# Altium project nufsr-p00.PrjPcb
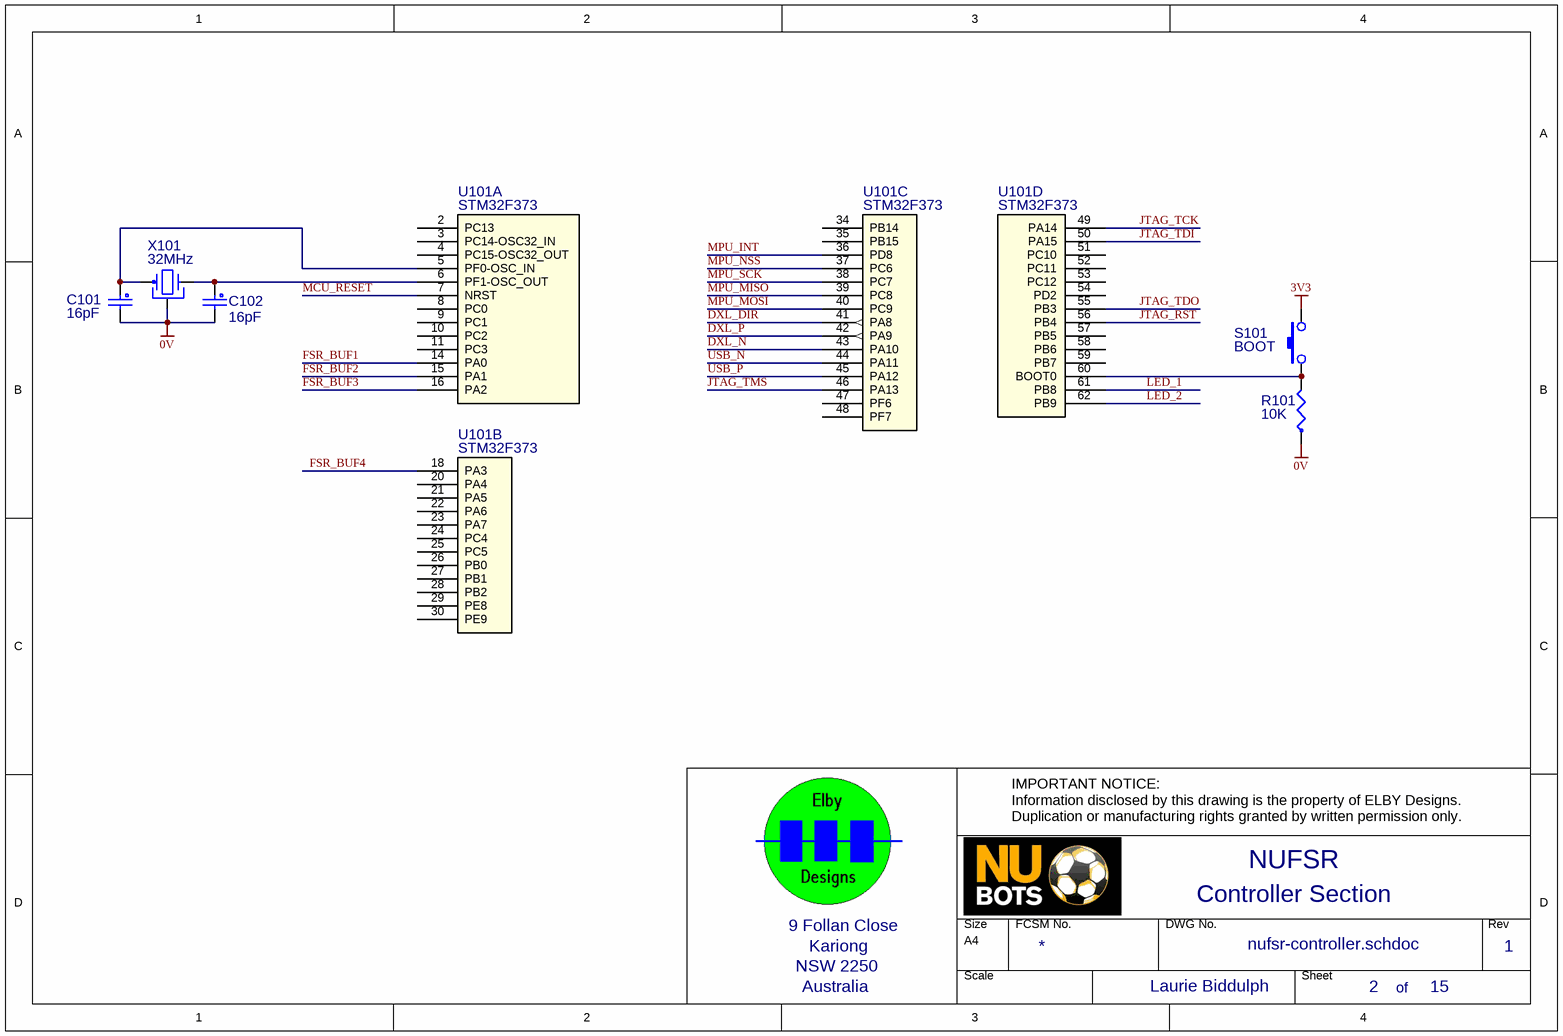
[diagram p0: nufsr-controller.schdoc]
PrjTitle: NUFSR
7 sheets, 76 parts. Net scope: global (net labels, ports and power ports of the same name join across sheets).
Board file: nufsr-p00.PcbDoc
Sheets:
  nufsr-controller.schdoc
  nufsr-fsr.schdoc
  nufsr-motion-sensor.schdoc
  nufsr-power.schdoc
    DECOUPLING = nufsr-power-decoupling.schdoc
  nufsr-rs485.schdoc
  nufsr-user-io.schdoc

## Sheet nufsr-controller.schdoc: NUSense
size A4; Organization: Elby Designs; Address1: 9 Follan Close; Address2: Kariong; Address3: NSW 2250; Address4: Australia; Revision: 1; SheetNumber: 2; SheetTotal: 15; DrawnBy: Controller Section; Engineer: Laurie Biddulph; PageSetup: Record=PageOptions|CenterHorizontal=True|CenterVertical=True|PrintScale=1.38|XCorrection=1.00|YCorrection=1.00|PrintKind=1|BorderSize=5000000|LeftOffset=0|BottomOffset=0|Orientation=2|PaperLength=1000|PaperWidth=1000|Scale=100|PaperSource=7|PrintQuality=-4|MediaType=1|DitherType=10|PaperKind=A3|PrintScaleMode=1

### Parts
C101  16pF  [0805(LB)]
C102  16pF  [0805(LB)]
R101  10K  [0603(LB)]
S101  BOOT  [HDR1X2(LB)]
U101  STM32F373  [LQFP-64_10x10(LB)]  (parts A,B,C,D of 5)
X101  32MHz  [CRYSTAL-3(LB)]

### Nets
0V: C101.2 C102.2 R101.1 X101.3
3V3: S101.1(COM)
DXL_DIR: U101.41(PA8)
DXL_N: U101.43(PA10)
DXL_P: U101.42(PA9)
FSR_BUF1: U101.14(PA0)
FSR_BUF2: U101.15(PA1)
FSR_BUF3: U101.16(PA2)
FSR_BUF4: U101.18(PA3)
JTAG_RST: U101.56(PB4)
JTAG_TCK: U101.49(PA14)
JTAG_TDI: U101.50(PA15)
JTAG_TDO: U101.55(PB3)
JTAG_TMS: U101.46(PA13)
LED_1: U101.61(PB8)
LED_2: U101.62(PB9)
MCU_~{RESET}: U101.7(NRST)
MPU_INT: U101.36(PD8)
MPU_MISO: U101.39(PC8)
MPU_MOSI: U101.40(PC9)
MPU_NSS: U101.37(PC6)
MPU_SCK: U101.38(PC7)
USB_N: U101.44(PA11)
USB_P: U101.45(PA12)
NetC101_1: C101.1 U101.5(PF0-OSC_IN) X101.1
NetC102_1: C102.1 U101.6(PF1-OSC_OUT) X101.2
NetR101_2: R101.2 S101.2(NO) U101.60(BOOT0)

Not connected (* = marked no-connect by the designer): U101 2(PC13) 3(PC14-OSC32_IN) 4(PC15-OSC32_OUT) 8(PC0) 9(PC1) 10(PC2) 11(PC3) 20(PA4) 21(PA5) 22(PA6) 23(PA7) 24(PC4) 25(PC5) 26(PB0) 27(PB1) 28(PB2) 29(PE8) 30(PE9) 34(PB14) 35(PB15) 47(PF6) 48(PF7) 51(PC10) 52(PC11) 53(PC12) 54(PD2) 57(PB5) 58(PB6) 59(PB7)

### Notes on the sheet
- IMPORTANT NOTICE:
  Information disclosed by this drawing is the property of ELBY Designs.
  Duplication or manufacturing rights granted by written permission only.
- of

### Library data of the parts
C101 C102 = CC-10PF(LB): NPO Low K, 50VDC Ceramic Disc; EMRP: CC-10PF
R101 = RM-10K(LB): 0.5W 1% Metal Film Resistor; EMRP: RM-10K
S101 = SW-PB-SPST(LB): PCB Push-button Switch; Text Field2: SP-0600
U101 = STM32F373: 32-bit Microcontroller; Manufacturer_Part_Number: stm32f74xzxt; Vendor: STMicroelectronics; C: Copyright (C) 2016 Accelerated Designs. All rights reserved; Copyright: Copyright (C) 2016 Accelerated Designs. All rights reserved; Value: Value; Type: Type; RefDes: RefDes
X101 = XTAL-24MHZ(LB): 24MHz Parallel-cut Crystal - HC49; EMRP: ZT-20MHZ

## Sheet nufsr-fsr.schdoc: NUSense
size A4; Organization: Elby Designs; Address1: 9 Follan Close; Address2: Kariong; Address3: NSW 2250; Address4: Australia; Revision: 1; SheetNumber: 12; SheetTotal: 15; DrawnBy: Force-Sense Resistors (FSR); Engineer: Laurie Biddulph; PageSetup: Record=PageOptions|CenterHorizontal=True|CenterVertical=True|PrintScale=1.38|XCorrection=1.00|YCorrection=1.00|PrintKind=1|BorderSize=5000000|LeftOffset=0|BottomOffset=0|Orientation=2|PaperLength=1000|PaperWidth=1000|Scale=100|PaperSource=7|PrintQuality=-4|MediaType=1|DitherType=10|PaperKind=A3|PrintScaleMode=1
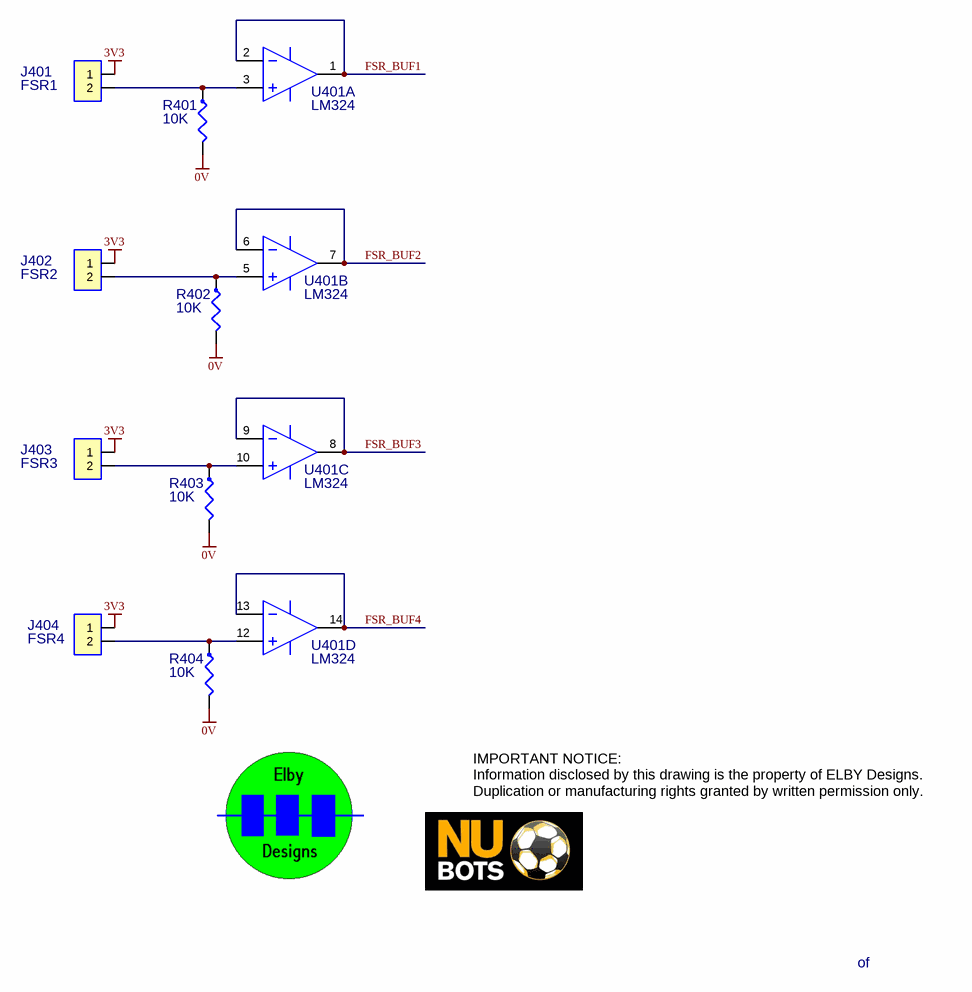
[diagram p1: nufsr-fsr.schdoc]

### Parts
J401  FSR1  [JST-B2B-PH]
J402  FSR2  [JST-B2B-PH]
J403  FSR3  [JST-B2B-PH]
J404  FSR4  [JST-B2B-PH]
R401  10K  [0603(LB)]
R402  10K  [0603(LB)]
R403  10K  [0603(LB)]
R404  10K  [0603(LB)]
U401  LM324  [SO-14(LB)]  (parts A,B,C,D of 5)

### Nets
0V: R401.2 R402.2 R403.2 R404.2
3V3: J401.1 J402.1 J403.1 J404.1
FSR_BUF1: U401.1(OUT) U401.2(IN1-)
FSR_BUF2: U401.6(IN2-) U401.7(OUT)
FSR_BUF3: U401.8(OUT) U401.9(IN3-)
FSR_BUF4: U401.13(IN4-) U401.14(OUT)
NetJ401_2: J401.2 R401.1 U401.3(IN1+)
NetJ402_2: J402.2 R402.1 U401.5(IN2+)
NetJ403_2: J403.2 R403.1 U401.10(IN3+)
NetJ404_2: J404.2 R404.1 U401.12(IN4+)

### Notes on the sheet
- IMPORTANT NOTICE:
  Information disclosed by this drawing is the property of ELBY Designs.
  Duplication or manufacturing rights granted by written permission only.
- of

### Library data of the parts
J401-J404 = CON2(LB): EMRP: HM-3412 + HM-3402
R401-R404 = RM-10K(LB): as R101 on sheet nufsr-controller
U401 = LM324(LB): Quad Low-noise JFET Op-amp; EMRP: SI-3-LM324

## Sheet nufsr-motion-sensor.schdoc: NUSense
size A4; Organization: Elby Designs; Address1: 9 Follan Close; Address2: Kariong; Address3: NSW 2250; Address4: Australia; Revision: 1; SheetNumber: 3; SheetTotal: 15; DrawnBy: Motion Tracking Sensor; Engineer: Laurie Biddulph; PageSetup: Record=PageOptions|CenterHorizontal=True|CenterVertical=True|PrintScale=1.38|XCorrection=1.00|YCorrection=1.00|PrintKind=1|BorderSize=5000000|LeftOffset=0|BottomOffset=0|Orientation=2|PaperLength=1000|PaperWidth=1000|Scale=100|PaperSource=7|PrintQuality=-4|MediaType=1|DitherType=10|PaperKind=A3|PrintScaleMode=1
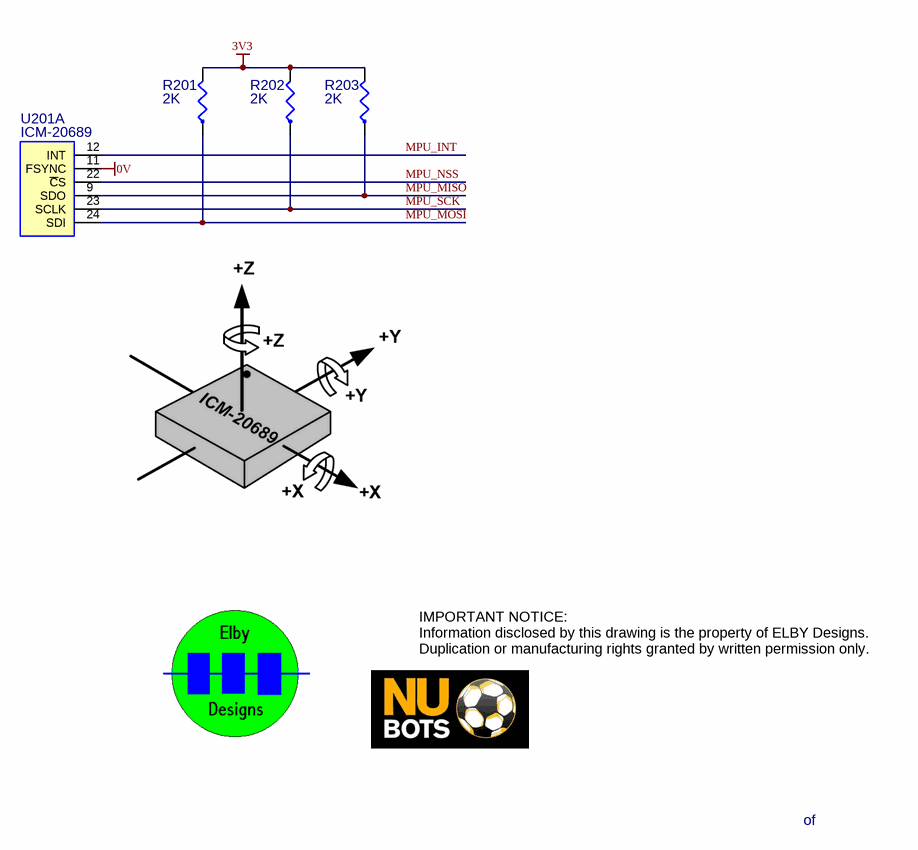
[diagram p2: nufsr-motion-sensor.schdoc]

### Parts
R201  2K  [0603(LB)]
R202  2K  [0603(LB)]
R203  2K  [0603(LB)]
U201  ICM-20689  [QFN-24]  (part A of 3)

### Nets
0V: U201.11(FSYNC)
3V3: R201.2 R202.2 R203.2
MPU_INT: U201.12(INT)
MPU_MISO: R203.1 U201.9(SDO)
MPU_MOSI: R201.1 U201.24(SDI)
MPU_NSS: U201.22(~{C}S)
MPU_SCK: R202.1 U201.23(SCLK)

### Notes on the sheet
- IMPORTANT NOTICE:
  Information disclosed by this drawing is the property of ELBY Designs.
  Duplication or manufacturing rights granted by written permission only.
- of

### Library data of the parts
R201-R203 = RM-2K(LB): 0.5W 1% Metal Film Resistor; EMRP: RM-2K
U201 = ICM-20869: Motion Tracking

## Sheet nufsr-power.schdoc: NUSense
size A4; Organization: Elby Designs; Address1: 9 Follan Close; Address2: Kariong; Address3: NSW 2250; Address4: Australia; Revision: 1; SheetNumber: 14; SheetTotal: 15; DrawnBy: Power Supply; Engineer: Laurie Biddulph; PageSetup: Record=PageOptions|CenterHorizontal=True|CenterVertical=True|PrintScale=1.38|XCorrection=1.00|YCorrection=1.00|PrintKind=1|BorderSize=5000000|LeftOffset=0|BottomOffset=0|Orientation=2|PaperLength=1000|PaperWidth=1000|Scale=100|PaperSource=7|PrintQuality=-4|MediaType=1|DitherType=10|PaperKind=A3|PrintScaleMode=1
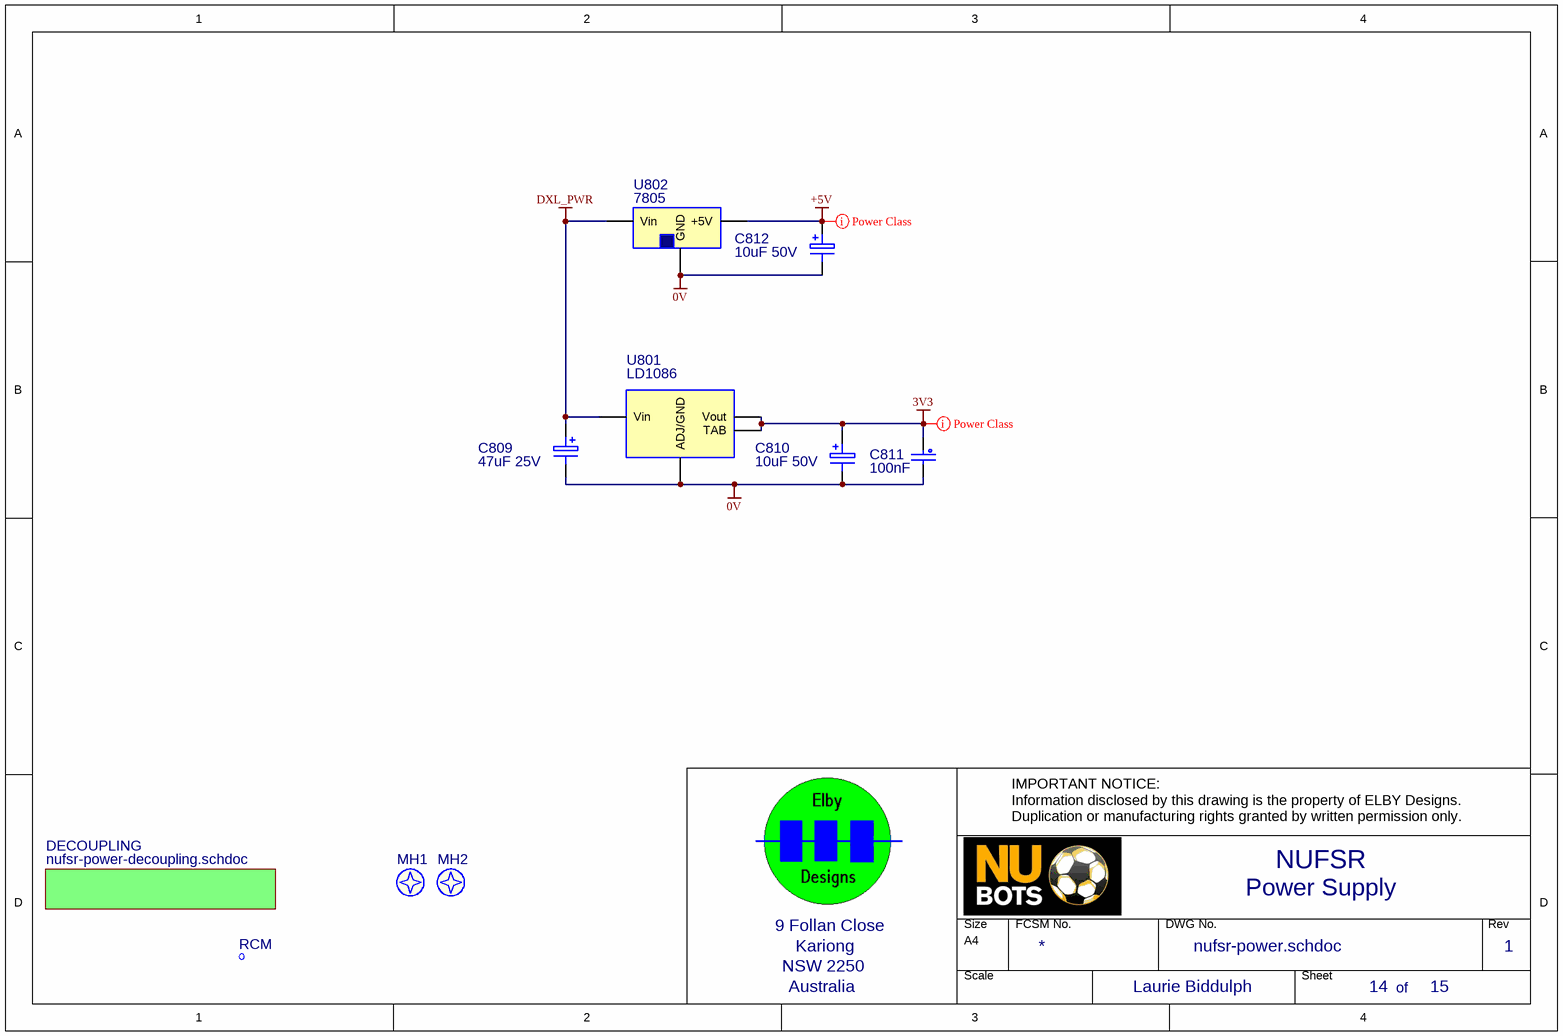
[diagram p3: nufsr-power.schdoc]

### Parts
C809  47uF 25V  [CASE-D(LB)]
C810  10uF 50V  [RB-D6.3-P2.5]
C811  100nF  [0603(LB)]
C812  10uF 50V  [RB-D6.3-P2.5]
MH1  Fixing  [HW-FIXING-3MM-PLASTIC]  (value not drawn)
MH2  Fixing  [HW-FIXING-3MM-PLASTIC]  (value not drawn)
RCM  HW-RCM(LB)  [HW-RCM]  (value not drawn)
U801  LD1086  [DPAK(LB)]
U802  7805  [DPAK(LB)]

### Sub-sheets
DECOUPLING = nufsr-power-decoupling.schdoc: no entries

### Nets
0V: C809.2 C810.2 C811.2 C812.2 U801.1(ADJ/GND) U802.2(GND)
3V3: C810.1 C811.1 U801.2(Vout) U801.TAB
+5V: C812.1 U802.3(+5V)
DXL_PWR: C809.1 U801.3(Vin) U802.1(Vin)

Not connected (* = marked no-connect by the designer): U802 TAB

### Layout directives
net class PowerClass: 3V3, +5V

### Notes on the sheet
- IMPORTANT NOTICE:
  Information disclosed by this drawing is the property of ELBY Designs.
  Duplication or manufacturing rights granted by written permission only.
- of

### Library data of the parts
C809 = CT-47UF35V(LB): 20% 35V Resin-dipped Tantalum; EMRP: CT-47UF
C810 C812 = CE-10UF50V(LB): 20% 50V Aluminium Electrolytic; EMRP: CE-10UF
C811 = CC-100NF(LB): Monolithic Ceramic; EMRP: CC-100NF
MH1 MH2 = HW-FIXING-ISOLATED(LB): M3/M4 Fixing Hole; EMRP: NA
RCM = HW-RCM(LB): N-Tick; EMRP: NA
U801 = LD1086(LB): 3-terminal Positive Voltage Regulator; Text Field1: 347-6870; Text Field2: ZV-1615; Text Field3: 512-KA317
U802 = 7805(LB): 3-terminal 1Amp Fixed Voltage Regulator; EMRP: SI-4-7805

## Sheet nufsr-power-decoupling.schdoc: NUSense
size A4; Organization: Elby Designs; Address1: 9 Follan Close; Address2: Kariong; Address3: NSW 2250; Address4: Australia; Revision: 1; SheetNumber: 15; SheetTotal: 15; DrawnBy: Power Supply Decoupling; Engineer: Laurie Biddulph; PageSetup: Record=PageOptions|CenterHorizontal=True|CenterVertical=True|PrintScale=1.38|XCorrection=1.00|YCorrection=1.00|PrintKind=1|BorderSize=5000000|LeftOffset=0|BottomOffset=0|Orientation=2|PaperLength=1000|PaperWidth=1000|Scale=100|PaperSource=7|PrintQuality=-4|MediaType=1|DitherType=10|PaperKind=A3|PrintScaleMode=1
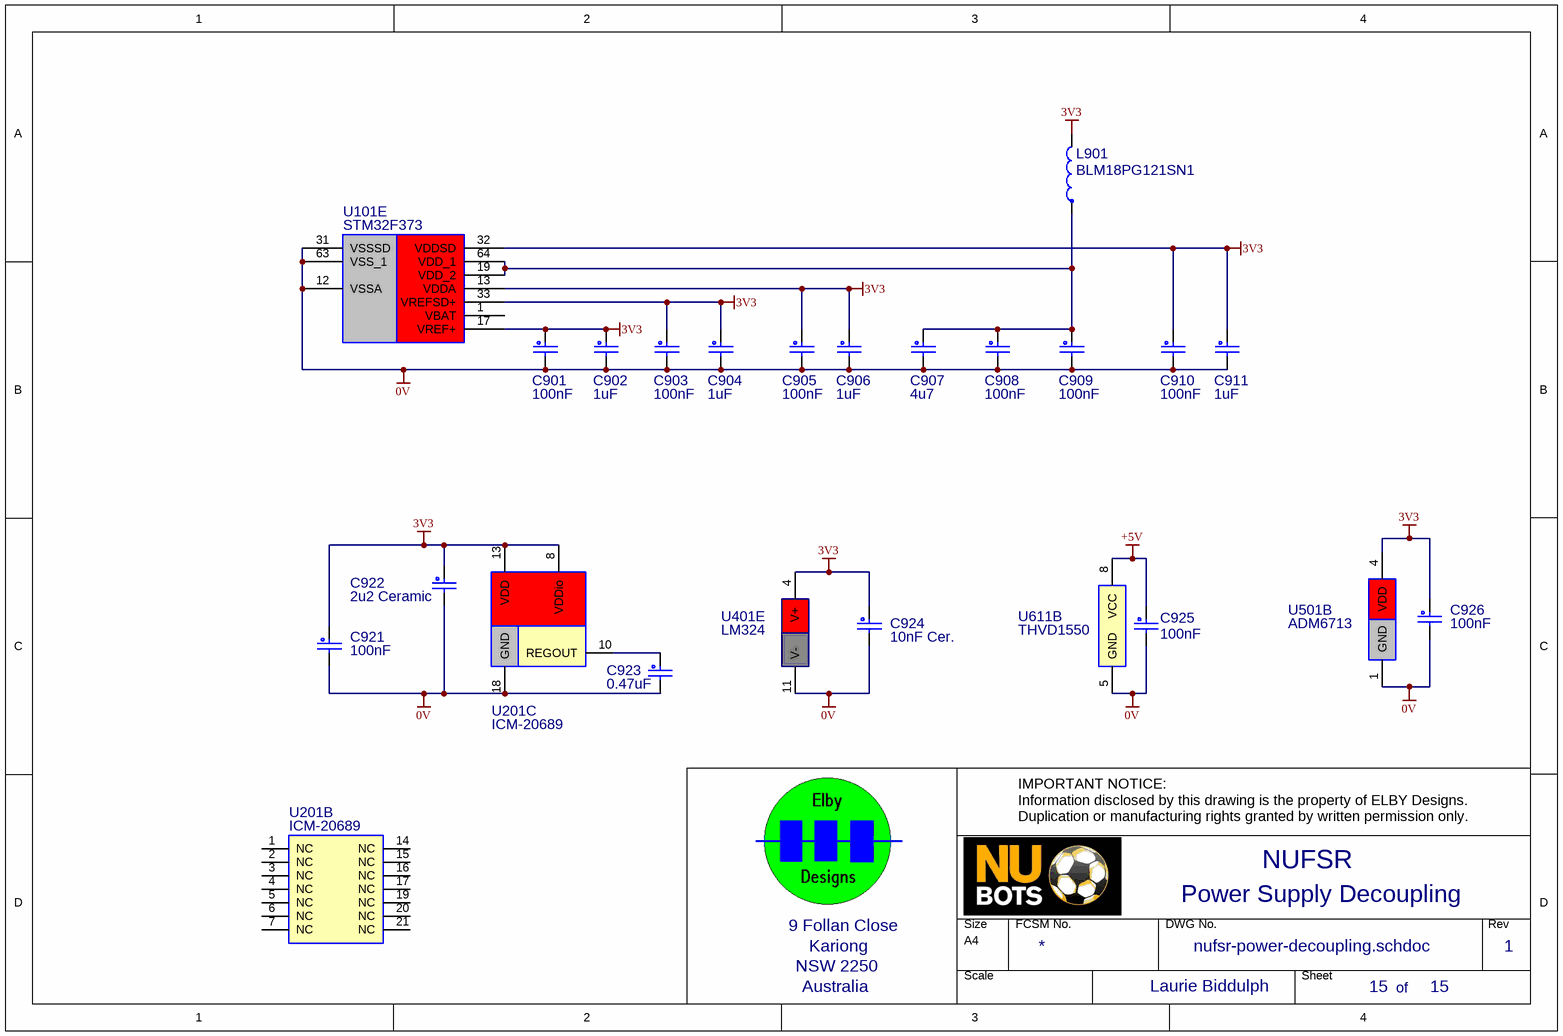
[diagram p4: nufsr-power-decoupling.schdoc]

### Parts
C901  100nF  [0603(LB)]
C902  1uF  [0805(LB)]
C903  100nF  [0603(LB)]
C904  1uF  [0805(LB)]
C905  100nF  [0603(LB)]
C906  1uF  [0805(LB)]
C907  4u7  [0805(LB)]
C908  100nF  [0603(LB)]
C909  100nF  [0603(LB)]
C910  100nF  [0603(LB)]
C911  1uF  [0805(LB)]
C921  100nF  [0603(LB)]
C922  2u2 Ceramic  [0805(LB)]
C923  0.47uF  [0805(LB)]
C924  10nF Cer.  [0603(LB)]
C925  100nF  [0603(LB)]
C926  100nF  [0603(LB)]
L901  value BLM18PG121SN1  [0603(LB)]  (hidden comment: Ferrite Bead)
U101  STM32F373  [LQFP-64_10x10(LB)]  (part E of 5)
U201  ICM-20689  [QFN-24]  (parts B,C of 3)
U401  LM324  [SO-14(LB)]  (part E of 5)
U501  ADM6713  [SC70-4]  (part B of 2)
U611  THVD1550  [SO-8(LB)]  (part B of 2)

### Nets
0V: C901.2 C902.2 C903.2 C904.2 C905.2 C906.2 C907.2 C908.2 C909.2 C910.2 C911.2 C921.2 C922.2 C923.2 C924.2 C925.2 C926.2 U101.12(VSSA) U101.31(VSSSD) U101.63(VSS_1) U201.18(GND) U401.11(V-) U501.1(GND) U611.5(GND)
3V3: C901.1 C902.1 C903.1 C904.1 C905.1 C906.1 C910.1 C911.1 C921.1 C922.1 C924.1 C926.1 L901.2 U101.13(VDDA) U101.17(VREF+) U101.32(VDDSD) U101.33(VREFSD+) U201.8(VDDio) U201.13(VDD) U401.4(V+) U501.4(VDD)
+5V: C925.1 U611.8(VCC)
NetC907_1: C907.1 C908.1 C909.1 L901.1 U101.19(VDD_2) U101.64(VDD_1)
NetC923_1: C923.1 U201.10(REGOUT)

Not connected (* = marked no-connect by the designer): U101 1(VBAT); U201 1(NC) 2(NC) 3(NC) 4(NC) 5(NC) 6(NC) 7(NC) 14(NC) 15(NC) 16(NC) 17(NC) 19(NC) 20(NC) 21(NC)

### Notes on the sheet
- IMPORTANT NOTICE:
  Information disclosed by this drawing is the property of ELBY Designs.
  Duplication or manufacturing rights granted by written permission only.
- of

### Library data of the parts
C901 C903 C905 C908-C910 C921 C925 C926 = CC-100NF(LB): Monolithic Ceramic; EMRP: CC-100NF
C902 C904 C906 C911 = CC-1000NF(LB): 1uF Ceramic; EMRP: CC-1000NF
C907 = CC-4700NF(LB): 4.7uF Ceramic; EMRP: CC-4700NF
C922 = CC-2200NF(LB): 2.2uF Ceramic; EMRP: CC-2200NF
C923 = CP-470NF(LB): 63V 10% Metallised Polyester; EMRP: CP-470NF
C924 = CC-10NF(LB): Monolithic Ceramic; EMRP: CC-10NF
L901 = FERRITE-BEAD(LB): EMRP: IN-BEAD
U101 = STM32F373: as U101 on sheet nufsr-controller; Copyright: Copyright (C) 2016 Accelerated Designs. All rights reserved; Value: Value; Type: Type; RefDes: RefDes
U201 = ICM-20869: Motion Tracking
U401 = LM324(LB): as U401 on sheet nufsr-fsr
U501 = ADM6713: Microprocessor Supervisory Circuit
U611 = THVD1550(LB): RS485 Transceiver 18kV 50mbps; EMRP: SI-1-MAX485

## Sheet nufsr-rs485.schdoc: NUSense
size A4; Organization: Elby Designs; Address1: 9 Follan Close; Address2: Kariong; Address3: NSW 2250; Address4: Australia; Revision: 1; SheetNumber: 7; SheetTotal: 15; DrawnBy: RS485; Engineer: Laurie Biddulph; PageSetup: Record=PageOptions|CenterHorizontal=True|CenterVertical=True|PrintScale=1.38|XCorrection=1.00|YCorrection=1.00|PrintKind=1|BorderSize=5000000|LeftOffset=0|BottomOffset=0|Orientation=2|PaperLength=1000|PaperWidth=1000|Scale=100|PaperSource=7|PrintQuality=-4|MediaType=1|DitherType=10|PaperKind=A3|PrintScaleMode=1
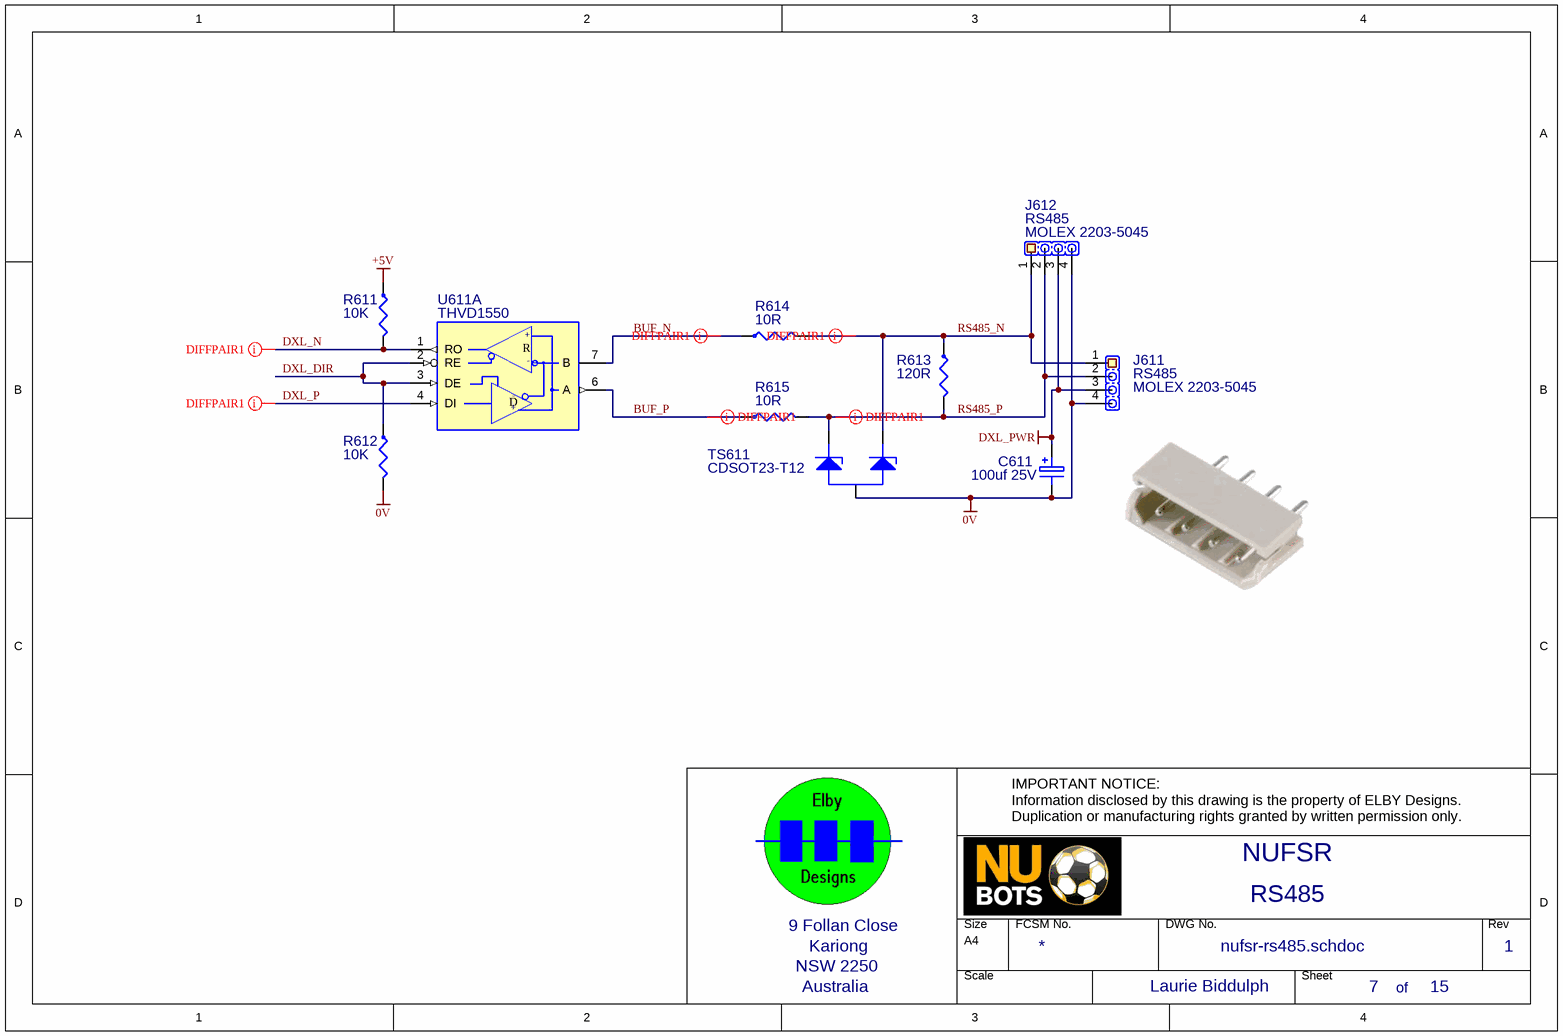
[diagram p5: nufsr-rs485.schdoc]

### Parts
C611  100uf 25V  [RB-D6.3-P2.5]
J611  RS485  PART: MOLEX 2203-5045  [CON-MOLEX_2203-5045]
J612  RS485  PART: MOLEX 2203-5045  [CON-MOLEX_2203-5045]
R611  10K  [0603(LB)]
R612  10K  [0603(LB)]
R613  120R  [0603(LB)]
R614  10R  [0603(LB)]
R615  10R  [0603(LB)]
TS611  CDSOT23-T12  [SOT-23-3(LB)]
U611  THVD1550  [SO-8(LB)]  (part A of 2)

### Nets
0V: C611.2 J611.4 J612.4 R612.2 TS611.3
+5V: R611.1
DXL_PWR: C611.1 J611.3 J612.3
BUF_N: R614.1 U611.7(B)
BUF_P: R615.1 U611.6(A)
DXL_DIR: R612.1 U611.2(RE) U611.3(DE)
DXL_N: R611.2 U611.1(RO)
DXL_P: U611.4(DI)
RS485_N: J611.1 J612.1 R613.1 R614.2 TS611.1
RS485_P: J611.2 J612.2 R613.2 R615.2 TS611.2

### Layout directives
differential pair: BUF_N, BUF_P, DXL_N, DXL_P, RS485_N, RS485_P

### Notes on the sheet
- IMPORTANT NOTICE:
  Information disclosed by this drawing is the property of ELBY Designs.
  Duplication or manufacturing rights granted by written permission only.
- of
- (in symbol THVD1550(LB), part A) +; R; -; D

### Library data of the parts
C611 = CE-100UF50V(LB): 20% 50V Aluminium Electrolytic; EMRP: CE-100UF
J611 J612 = HEADER-1X4: 1x4 Header; EMRP: JH-1X4
R611 R612 = RM-10K(LB): as R101 on sheet nufsr-controller
R613 = RM-120R(LB): 0.5W 1% Metal Film Resistor; EMRP: RM-120R
R614 R615 = RP-10R(LB): 10R Pulse-proof; EMRP: RC-0R68-1W
TS611 = CDSOT23-T12(LB): 600V Bi-directional Transient Suppressor; EMRP: SD-TRANSORB
U611 = THVD1550(LB): as U611 on sheet nufsr-power-decoupling

## Sheet nufsr-user-io.schdoc: NUSense
size A4; Organization: Elby Designs; Address1: 9 Follan Close; Address2: Kariong; Address3: NSW 2250; Address4: Australia; Revision: 1; SheetNumber: 6; SheetTotal: 15; DrawnBy: User Interface; Engineer: Laurie Biddulph; PageSetup: Record=PageOptions|CenterHorizontal=True|CenterVertical=True|PrintScale=1.38|XCorrection=1.00|YCorrection=1.00|PrintKind=1|BorderSize=5000000|LeftOffset=0|BottomOffset=0|Orientation=2|PaperLength=1000|PaperWidth=1000|Scale=100|PaperSource=7|PrintQuality=-4|MediaType=1|DitherType=10|PaperKind=A3|PrintScaleMode=1
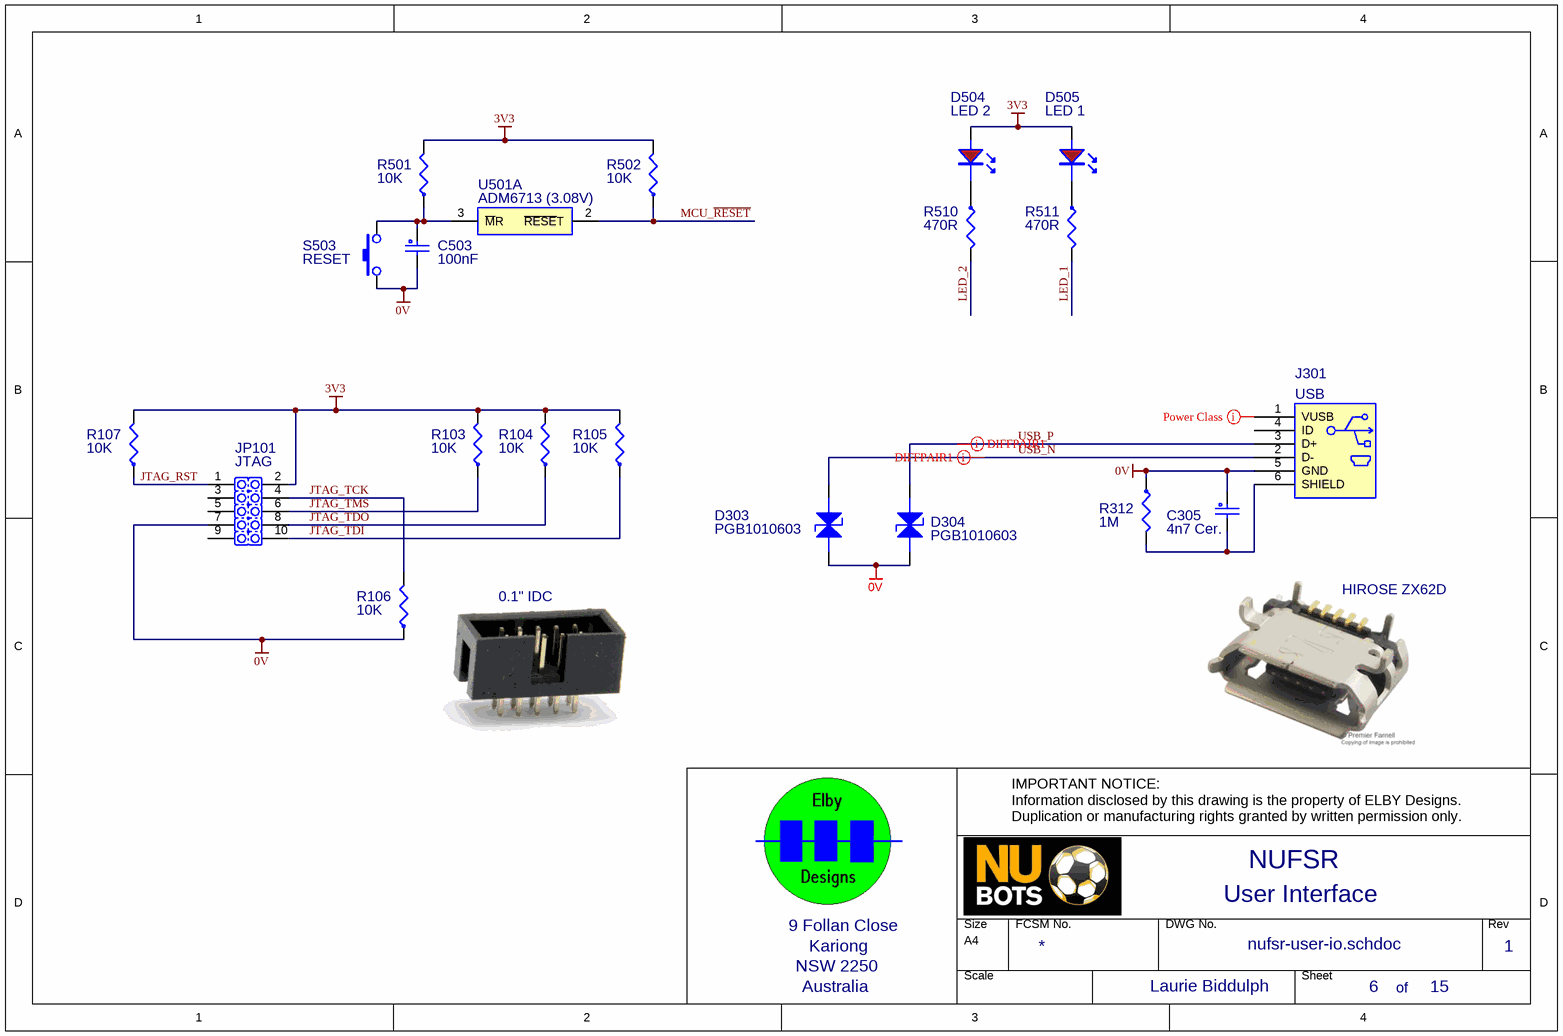
[diagram p6: nufsr-user-io.schdoc]

### Parts
C305  4n7 Cer.  [0603(LB)]
C503  100nF  [0603(LB)]
D303  PGB1010603  [0603(LB)]
D304  PGB1010603  [0603(LB)]
D504  LED 2  [LED-0603(LB)]
D505  LED 1  [LED-0603(LB)]
J301  USB  [USB-ZX62D]
JP101  JTAG  [HDR2X5(LB)]
R103  10K  [0603(LB)]
R104  10K  [0603(LB)]
R105  10K  [0603(LB)]
R106  10K  [0603(LB)]
R107  10K  [0603(LB)]
R312  1M  [0603(LB)]
R501  10K  [0603(LB)]
R502  10K  [0603(LB)]
R510  470R  [0603(LB)]
R511  470R  [0603(LB)]
S503  RESET  [HDR1X2(LB)]
U501  ADM6713 (3.08V)  [SC70-4]  (part A of 2)

### Nets
0V: C305.1 C503.2 D303.2 D304.2 J301.5(GND) JP101.7 R106.1 R312.1 S503.1(COM)
3V3: D504.A D505.A JP101.2 R103.2 R104.2 R105.2 R107.2 R501.2 R502.2
JTAG_RST: JP101.1 R107.1
JTAG_TCK: JP101.4 R106.2
JTAG_TDI: JP101.10 R105.1
JTAG_TDO: JP101.8 R104.1
JTAG_TMS: JP101.6 R103.1
LED_1: R511.2
LED_2: R510.2
MCU_~{RESET}: R502.1 U501.2(~{RESE}T)
USB_N: D303.1 J301.2(D-)
USB_P: D304.1 J301.3(D+)
NetC305_2: C305.2 J301.6(SHIELD) R312.2
NetC503_1: C503.1 R501.1 S503.2(NO) U501.3(~{M}R)
NetD504_K: D504.K R510.1
NetD505_K: D505.K R511.1

Not connected (* = marked no-connect by the designer): J301 1(VUSB) 4(ID); JP101 3 5 9

### Layout directives
net class PowerClass: NetJ301_1
differential pair: USB_N, USB_P

### Notes on the sheet
- 0.1" IDC
- HIROSE ZX62D
- IMPORTANT NOTICE:
  Information disclosed by this drawing is the property of ELBY Designs.
  Duplication or manufacturing rights granted by written permission only.
- of

### Library data of the parts
C305 = CC-4700PF(LB): 4700pF NPO, 50VDC Ceramic Disc; EMRP: CC-4700PF
C503 = CC-100NF(LB): Monolithic Ceramic; EMRP: CC-100NF
D303 D304 = PGB1010603: 500V Pulse-Guard; EMRP: SD-TRANSORB
D504 D505 = LED-RED(LB): LED
J301 = ZX62D-B-5P8
JP101 = HDR2X5(LB): Connector
R103-R107 R501 R502 = RM-10K(LB): as R101 on sheet nufsr-controller
R312 = RM-1M(LB): 0.5W 1% Metal Film Resistor; EMRP: RM-1M
R510 R511 = RM-470R(LB): 0.5W 1% Metal Film Resistor; EMRP: RM-470R
S503 = SW-PB-SPST(LB): as S101 on sheet nufsr-controller
U501 = ADM6713: Microprocessor Supervisory Circuit

## Nets that join several sheets
0V: nufsr-controller (C101.2 C102.2 R101.1 X101.3), nufsr-fsr (R401.2 R402.2 R403.2 R404.2), nufsr-motion-sensor (U201.11), nufsr-power (6 pins), nufsr-power-decoupling (24 pins), nufsr-rs485 (5 pins), nufsr-user-io (9 pins)
3V3: nufsr-controller (S101.1), nufsr-fsr (J401.1 J402.1 J403.1 J404.1), nufsr-motion-sensor (R201.2 R202.2 R203.2), nufsr-power (C810.1 C811.1 U801.2 U801.TAB), nufsr-power-decoupling (21 pins), nufsr-user-io (9 pins)
+5V: nufsr-power (C812.1 U802.3), nufsr-power-decoupling (C925.1 U611.8), nufsr-rs485 (R611.1)
DXL_PWR: nufsr-power (C809.1 U801.3 U802.1), nufsr-rs485 (C611.1 J611.3 J612.3)
DXL_DIR: nufsr-controller (U101.41), nufsr-rs485 (R612.1 U611.2 U611.3)
DXL_N: nufsr-controller (U101.43), nufsr-rs485 (R611.2 U611.1)
DXL_P: nufsr-controller (U101.42), nufsr-rs485 (U611.4)
FSR_BUF1: nufsr-controller (U101.14), nufsr-fsr (U401.1 U401.2)
FSR_BUF2: nufsr-controller (U101.15), nufsr-fsr (U401.6 U401.7)
FSR_BUF3: nufsr-controller (U101.16), nufsr-fsr (U401.8 U401.9)
FSR_BUF4: nufsr-controller (U101.18), nufsr-fsr (U401.13 U401.14)
JTAG_RST: nufsr-controller (U101.56), nufsr-user-io (JP101.1 R107.1)
JTAG_TCK: nufsr-controller (U101.49), nufsr-user-io (JP101.4 R106.2)
JTAG_TDI: nufsr-controller (U101.50), nufsr-user-io (JP101.10 R105.1)
JTAG_TDO: nufsr-controller (U101.55), nufsr-user-io (JP101.8 R104.1)
JTAG_TMS: nufsr-controller (U101.46), nufsr-user-io (JP101.6 R103.1)
LED_1: nufsr-controller (U101.61), nufsr-user-io (R511.2)
LED_2: nufsr-controller (U101.62), nufsr-user-io (R510.2)
MCU_~{RESET}: nufsr-controller (U101.7), nufsr-user-io (R502.1 U501.2)
MPU_INT: nufsr-controller (U101.36), nufsr-motion-sensor (U201.12)
MPU_MISO: nufsr-controller (U101.39), nufsr-motion-sensor (R203.1 U201.9)
MPU_MOSI: nufsr-controller (U101.40), nufsr-motion-sensor (R201.1 U201.24)
MPU_NSS: nufsr-controller (U101.37), nufsr-motion-sensor (U201.22)
MPU_SCK: nufsr-controller (U101.38), nufsr-motion-sensor (R202.1 U201.23)
USB_N: nufsr-controller (U101.44), nufsr-user-io (D303.1 J301.2)
USB_P: nufsr-controller (U101.45), nufsr-user-io (D304.1 J301.3)